# EasyEDA schematic CLAVIER MIDI WOOD_2021-01-15.json
TITLE: MINI MIDI KEY; REV: 1.0; Date: 2020-03-29; Sheet: 1/1; Drawn By: g.leberruyer; Company: BERRU FACTORY
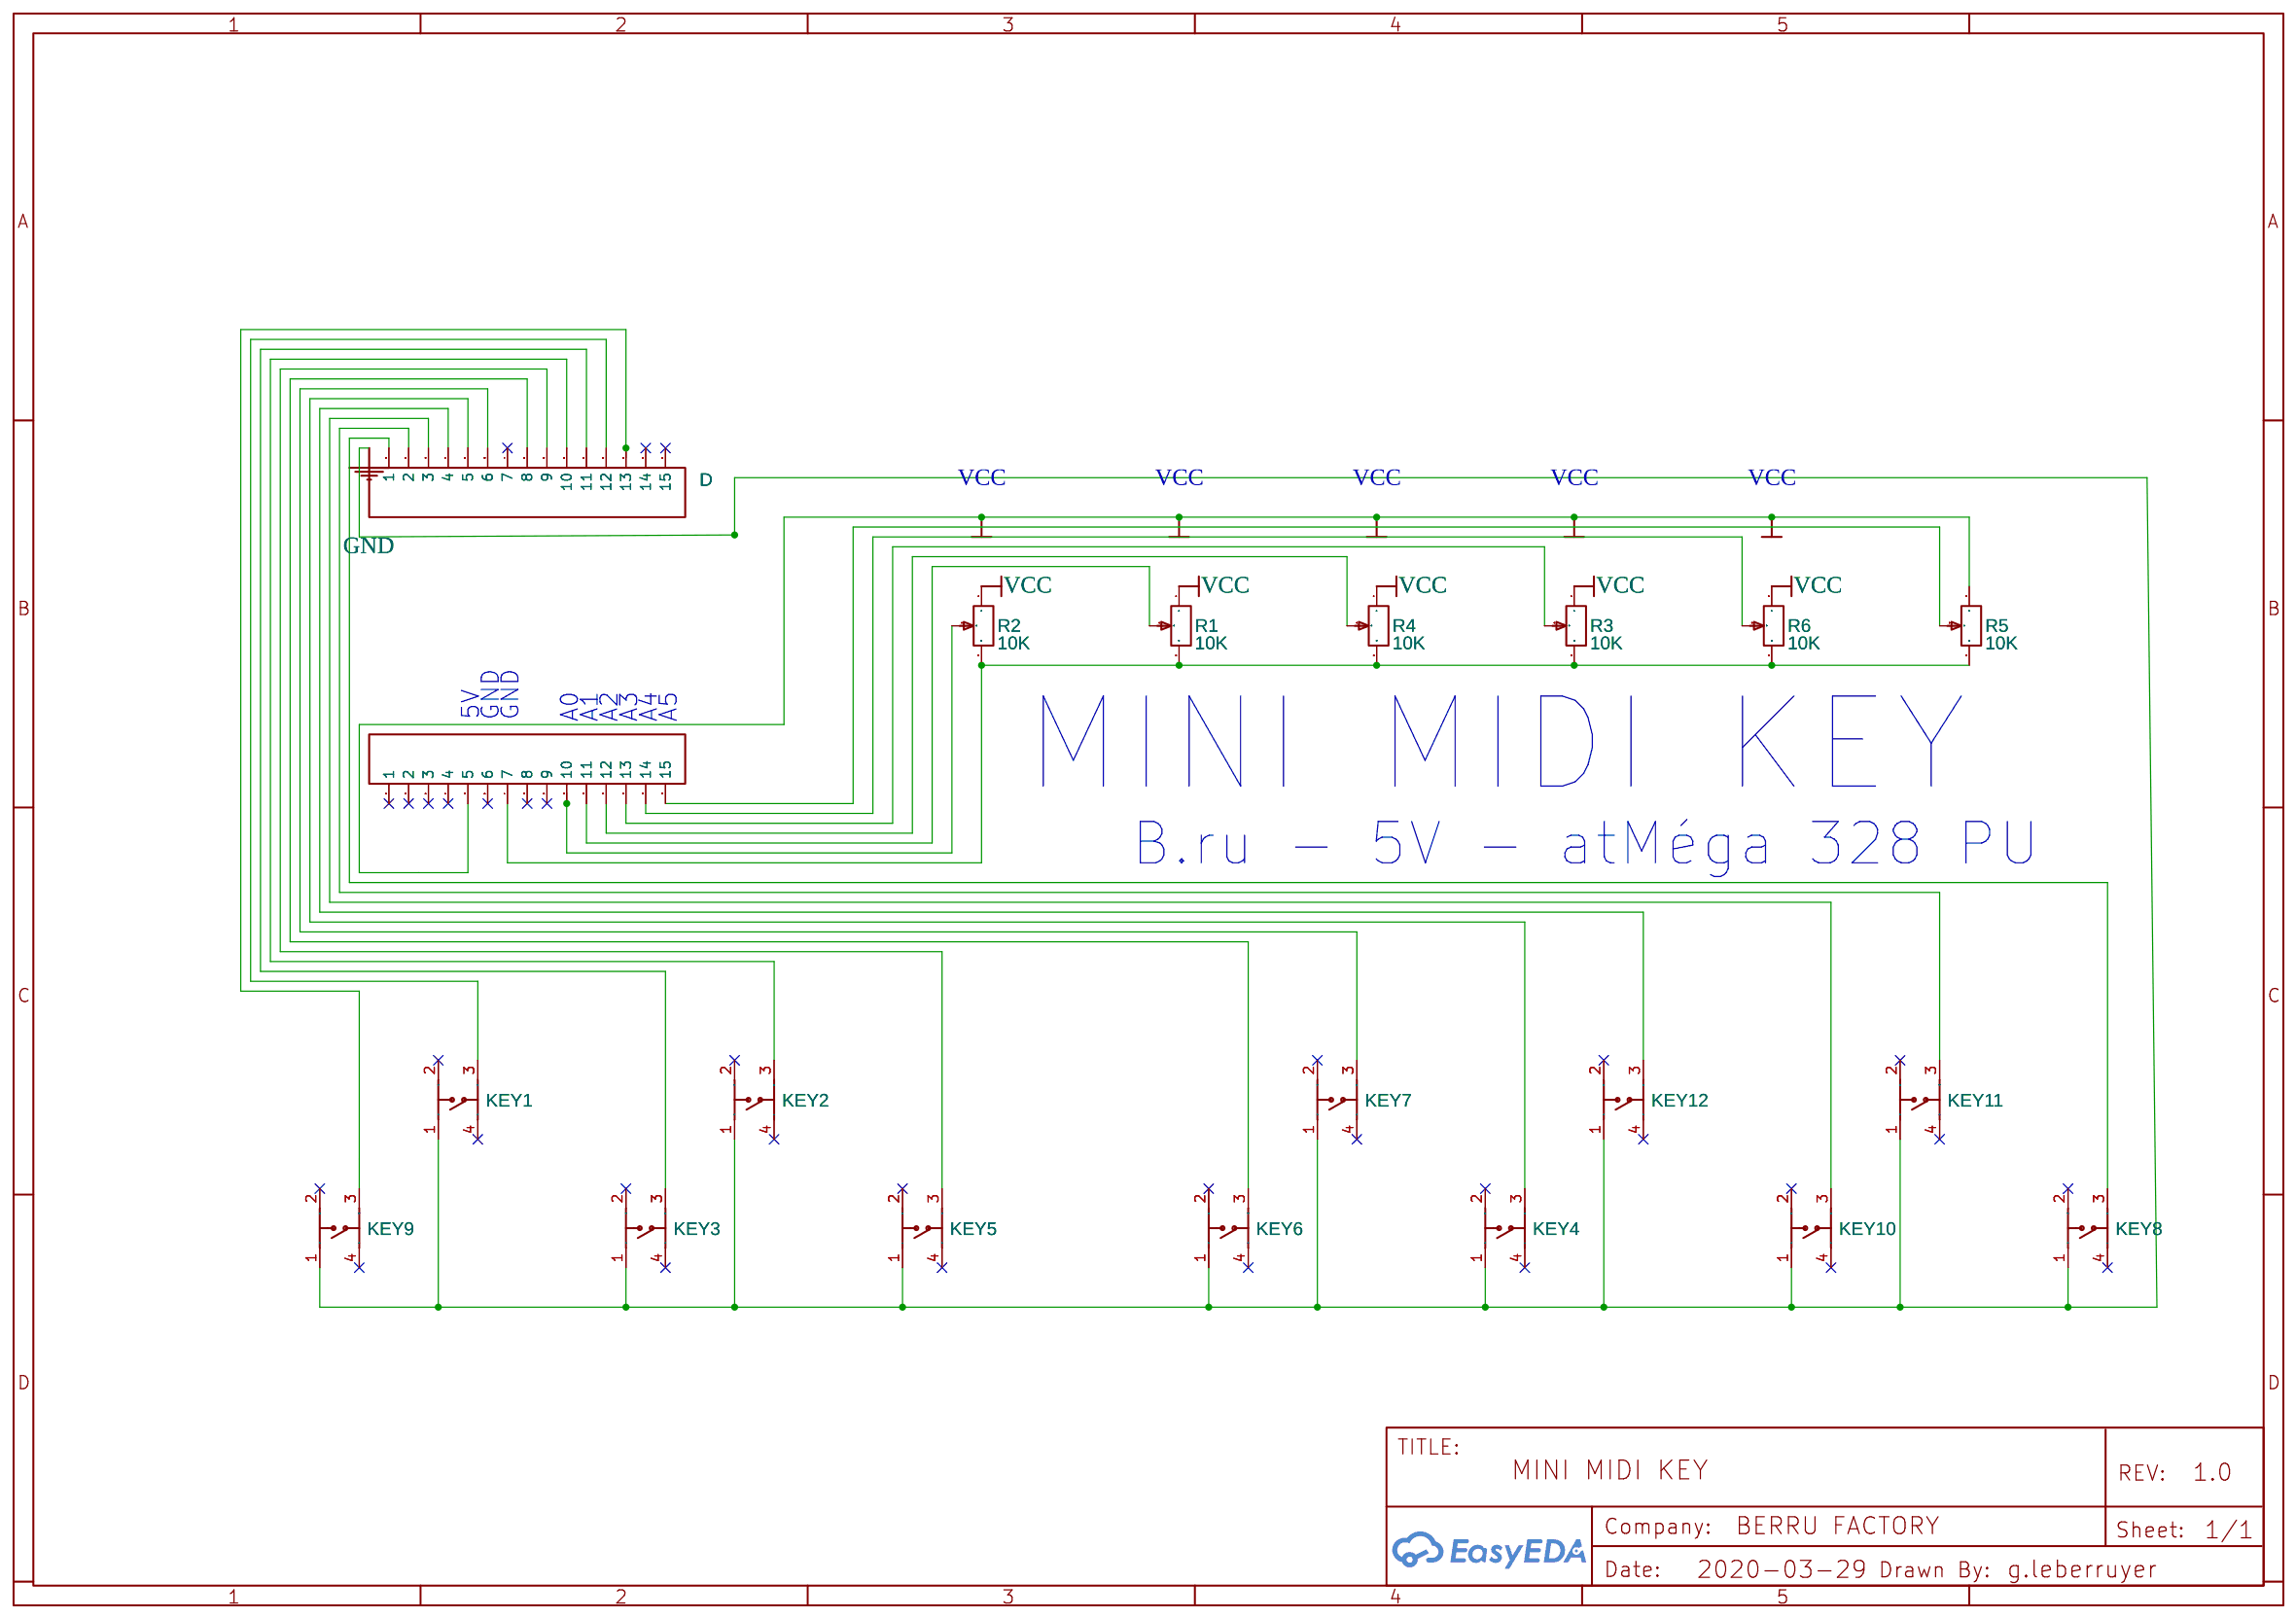
[diagram p0: schematic sheet]

## Parts
D  Header-Female-2.54_1x15  [DIP-1X15P2.54]
H1  Header-Female-2.54_1x15  [DIP-1X15P2.54]
KEY1  button6*6*8  [KEY-TH_4P-L6.0-W6.0-P4.50-LS7.5]
KEY2  button6*6*8  [KEY-TH_4P-L6.0-W6.0-P4.50-LS7.5]
KEY3  button6*6*8  [KEY-TH_4P-L6.0-W6.0-P4.50-LS7.5]
KEY4  button6*6*8  [KEY-TH_4P-L6.0-W6.0-P4.50-LS7.5]
KEY5  button6*6*8  [KEY-TH_4P-L6.0-W6.0-P4.50-LS7.5]
KEY6  button6*6*8  [KEY-TH_4P-L6.0-W6.0-P4.50-LS7.5]
KEY7  button6*6*8  [KEY-TH_4P-L6.0-W6.0-P4.50-LS7.5]
KEY8  button6*6*8  [KEY-TH_4P-L6.0-W6.0-P4.50-LS7.5]
KEY9  button6*6*8  [KEY-TH_4P-L6.0-W6.0-P4.50-LS7.5]
KEY10  button6*6*8  [KEY-TH_4P-L6.0-W6.0-P4.50-LS7.5]
KEY11  button6*6*8  [KEY-TH_4P-L6.0-W6.0-P4.50-LS7.5]
KEY12  button6*6*8  [KEY-TH_4P-L6.0-W6.0-P4.50-LS7.5]
R1  10K  [RES-ADJ-TH_RK097111080J]
R2  10K  [RES-ADJ-TH_RK097111080J]
R3  10K  [RES-ADJ-TH_RK097111080J]
R4  10K  [RES-ADJ-TH_RK097111080J]
R5  10K  [RES-ADJ-TH_RK097111080J]
R6  10K  [RES-ADJ-TH_RK097111080J]

## Library data of the parts
D H1 = Header-Female-2.54_1x15: Supplier: LCSC; Manufacturer: Ckmtw; Manufacturer Part: 220S-1*15P H=8.5MM Ytype Gold-plated; Supplier Part: C124408
KEY1-KEY12 = button6*6*8: Supplier Part: C59982; Supplier: LCSC; Manufacturer: ReliaPro; image: http://image.lceda.cn/szlcsc/C59982.jpg
R1-R6 = RK097111080J: Supplier: LCSC; Manufacturer: ALPS; Supplier Part: C97444

## Nets
GND: KEY1.1 KEY2.1 KEY3.1 KEY4.1 KEY5.1 KEY6.1 KEY7.1 KEY8.1 KEY9.1 KEY10.1 KEY11.1 KEY12.1
VCC: H1.5 R1.1 R2.1 R3.1 R4.1 R5.1 R6.1
Net-(D-1): D.1 KEY8.3
Net-(D-2): D.2 KEY11.3
Net-(D-3): D.3 KEY10.3
Net-(D-4): D.4 KEY12.3
Net-(D-5): D.5 KEY4.3
Net-(D-6): D.6 KEY7.3
Net-(D-8): D.8 KEY6.3
Net-(D-9): D.9 KEY5.3
Net-(D-10): D.10 KEY2.3
Net-(D-11): D.11 KEY3.3
Net-(D-12): D.12 KEY1.3
Net-(D-13): D.13 KEY9.3
Net-(H1-7): H1.7 R1.3 R2.3 R3.3 R4.3 R5.3 R6.3
Net-(H1-10): H1.10 R2.2
Net-(H1-11): H1.11 R1.2
Net-(H1-12): H1.12 R4.2
Net-(H1-13): H1.13 R3.2
Net-(H1-14): H1.14 R6.2
Net-(H1-15): H1.15 R5.2

Not connected (* = marked no-connect by the designer): D 7* 14* 15*; H1 1* 2* 3* 4* 6* 8* 9*; KEY1 2* 4*; KEY2 2* 4*; KEY3 2* 4*; KEY4 2* 4*; KEY5 2* 4*; KEY6 2* 4*; KEY7 2* 4*; KEY8 2* 4*; KEY9 2* 4*; KEY10 2* 4*; KEY11 2* 4*; KEY12 2* 4*

## Notes on the sheet
- ~
- ~
- ~
- ~
- ~
- ~
- TX
- RX
- ~
- ~
- ~
- ~
- ~
- ~
- Digital - PWM I/O
- Digital - PWM I/O
- TX
- RX
- Analog I/O
- Analog I/O
- MINI MIDI KEY
- 5V
- GND
- GND
- A0
- A1
- A2
- A3
- A4
- A5
- B.ru - 5V - atMéga 328 PU
